# Altium schematic sheet qmc5883l.SchDoc
size A4; Organization: Altium Limited; Address1: L3, 12a Rodborough Rd; Address2: Frenchs Forest; Address3: NSW; Address4: Australia 2086; SheetNumber: 6; SheetTotal: 10
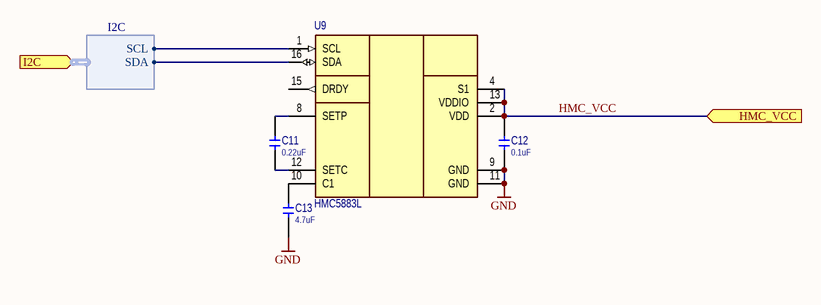
[diagram p0: qmc5883l.SchDoc]

## Parts
C11  value 0.22uF  [CERCAP 0402]
C12  value 0.1uF  [CERCAP 0402]
C13  value 4.7uF  [CERCAP 0603]
U9  HMC5883L  [LGA16_HMC5883L]

## Ports
HMC_VCC (in), I2C (in, harness I2C)

## Harnesses
I2C: SCL, SDA

## Nets
GND: C12.1 C13.1 U9.9(GND) U9.11(GND)
HMC_VCC: C12.2 U9.2(VDD) U9.4(S1) U9.13(VDDIO) ; port HMC_VCC
NetC11_1: C11.1 U9.12(SETC)
NetC11_2: C11.2 U9.8(SETP)
NetC13_2: C13.2 U9.10(C1)
NetU9_1: U9.1(SCL) ; port I2C.SCL
NetU9_16: U9.16(SDA) ; port I2C.SDA

Not connected (* = marked no-connect by the designer): U9 15(DRDY)

## Notes on the sheet
- Title
- Size:
- Date:
- A4
- Number:
- Time:
- Revision:
- Sheet
- of
- File:

## Library data of the parts
C11-C13 = !Capacitor: Capacitor; IsSMT: NoSMT; Diel: X7R; Voltage: *
U9 = Q/HMC5883l: Gyro